# EAGLE design PCB v.2_2021 (EAGLE 9.6.2)
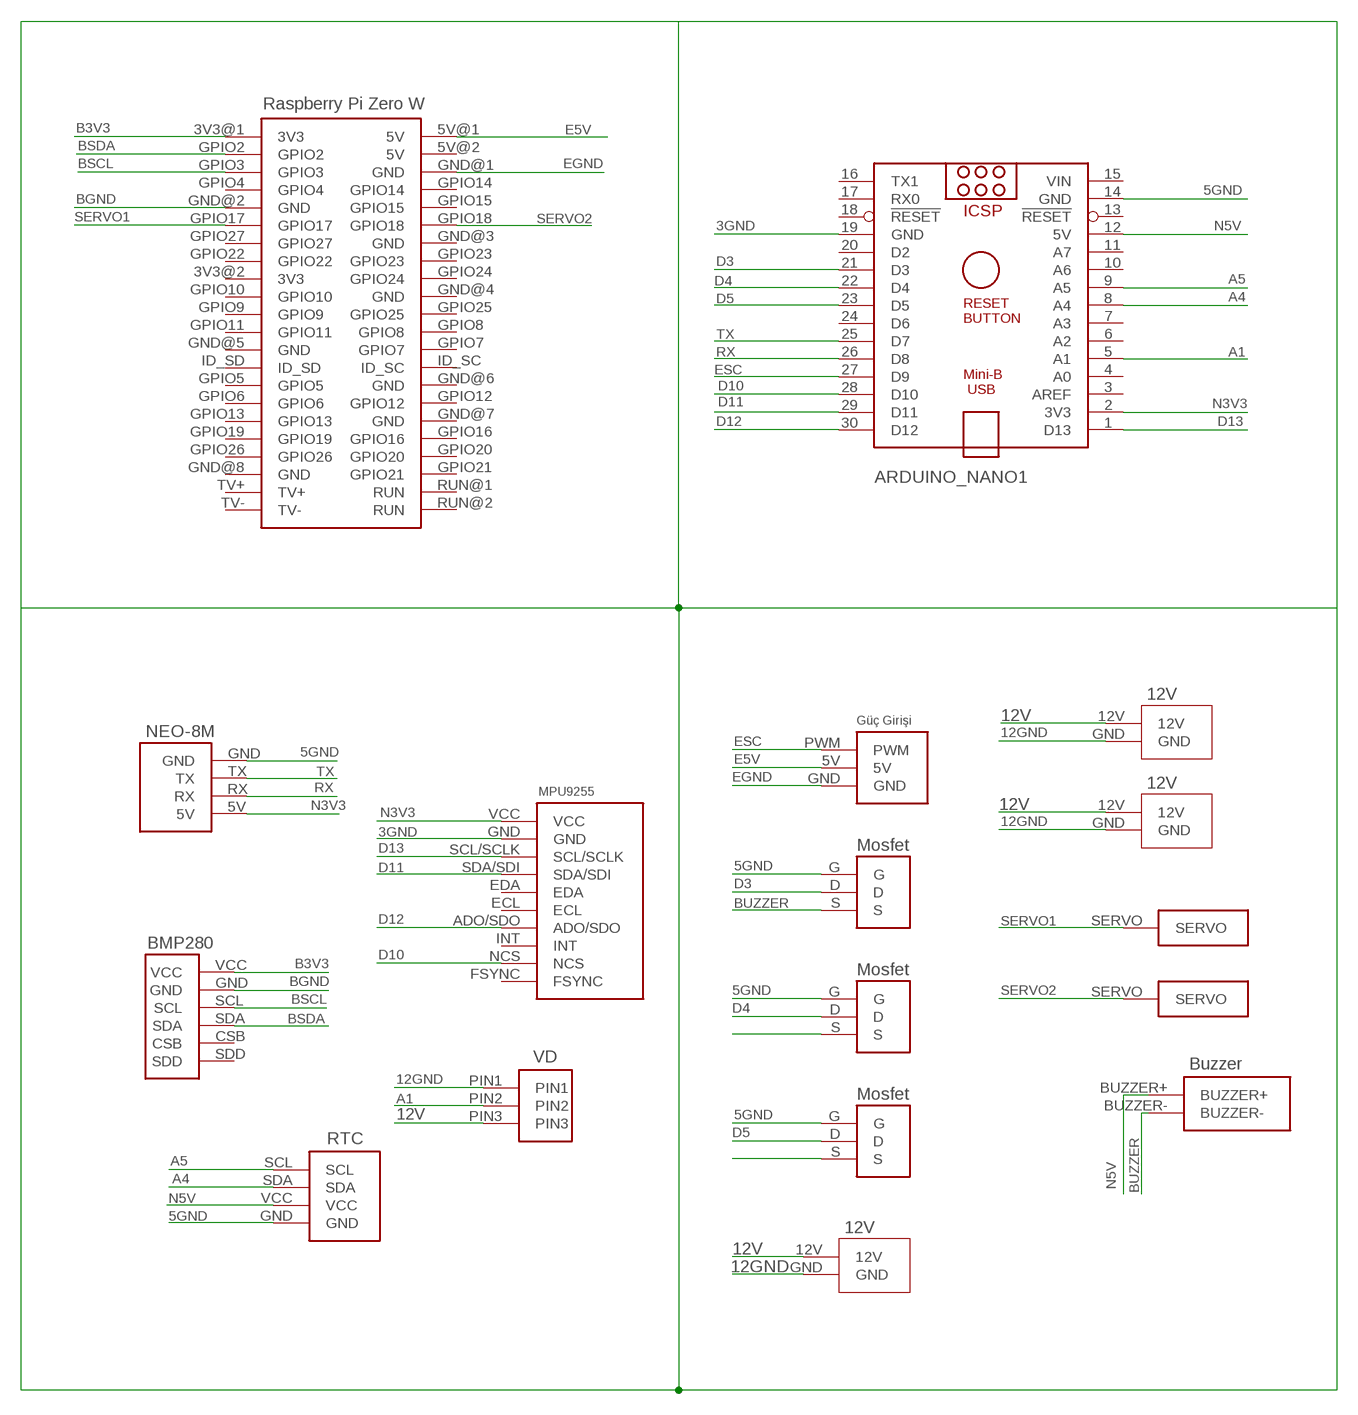
[diagram p0: schematic, sheet 1]

## Parts
ARDUINO_NANO1  ARDUINO_NANO  [ARDUINO_NANO]
BMP1  BMP280  [BMP280]
RPIZEROW1  RASPBERRY_ZERO_W  [RASPBERRY_ZERO_W]
U$1  NEOM8N  [NEO8M]
U$2  MPU9255  [MPU9255]
U$3  VOLTAGE_DIVIDER  [VOLTAGE_DIVIDER]
U$4  ESC_GIRIS  [ESC_GIRIS]
U$5  12V  [12V]
U$6  12V  [12V]
U$7  MOSFET  [MOSFET]
U$8  MOSFET  [MOSFET]
U$9  MOSFET  [MOSFET]
U$10  RTC  [RTC]
U$11  SERVO_SIGNAL  [SERVO_SIGNAL]
U$12  SERVO_SIGNAL  [SERVO_SIGNAL]
U$13  12V  [12V]
U$14  BUZZER  [BUZZER]

## Nets
3GND: ARDUINO_NANO1.19(GND) U$2.GND
5GND: ARDUINO_NANO1.14(GND) U$1.GND U$7.G U$8.G U$9.G U$10.GND
12GND: U$3.PIN1 U$5.GND U$6.GND U$13.GND
12V: U$3.PIN3 U$5.12V U$6.12V U$13.12V
A1: ARDUINO_NANO1.5(A1) U$3.PIN2
A4: ARDUINO_NANO1.8(A4) U$10.SDA
A5: ARDUINO_NANO1.9(A5) U$10.SCL
B3V3: BMP1.VCC RPIZEROW1.3V3@1(3V3)
BGND: BMP1.GND RPIZEROW1.GND@2(GND)
BSCL: BMP1.SCL RPIZEROW1.GPIO3
BSDA: BMP1.SDA RPIZEROW1.GPIO2
BUZZER: U$7.S U$14.BUZZER-
D3: ARDUINO_NANO1.21(D3) U$7.D
D4: ARDUINO_NANO1.22(D4) U$8.D
D5: ARDUINO_NANO1.23(D5) U$9.D
D10: ARDUINO_NANO1.28(D10) U$2.NCS
D11: ARDUINO_NANO1.29(D11) U$2.SDA/SDI
D12: ARDUINO_NANO1.30(D12) U$2.ADO/SDO
D13: ARDUINO_NANO1.1(D13) U$2.SCL/SCLK
E5V: RPIZEROW1.5V@1(5V) U$4.5V
EGND: RPIZEROW1.GND@1(GND) U$4.GND
ESC: ARDUINO_NANO1.27(D9) U$4.PWM
N3V3: ARDUINO_NANO1.2(3V3) U$1.5V U$2.VCC
N5V: ARDUINO_NANO1.12(5V) U$10.VCC U$14.BUZZER+
N$7: U$8.S
N$10: U$9.S
RX: ARDUINO_NANO1.26(D8) U$1.RX
SERVO1: RPIZEROW1.GPIO17 U$11.SERVO
SERVO2: RPIZEROW1.GPIO18 U$12.SERVO
TX: ARDUINO_NANO1.25(D7) U$1.TX
Unconnected: ARDUINO_NANO1.3(AREF) ARDUINO_NANO1.4(A0) ARDUINO_NANO1.6(A2) ARDUINO_NANO1.7(A3) ARDUINO_NANO1.10(A6) ARDUINO_NANO1.11(A7) ARDUINO_NANO1.13(!RESET) ARDUINO_NANO1.16(TX1) ARDUINO_NANO1.17(RX0) ARDUINO_NANO1.18(!RESET) ARDUINO_NANO1.20(D2) ARDUINO_NANO1.24(D6) BMP1.CSB BMP1.SDD RPIZEROW1.3V3@2(3V3) RPIZEROW1.5V@2(5V) RPIZEROW1.GND@3(GND) RPIZEROW1.GND@4(GND) RPIZEROW1.GND@5(GND) RPIZEROW1.GND@6(GND) RPIZEROW1.GND@7(GND) RPIZEROW1.GND@8(GND) RPIZEROW1.GPIO4 RPIZEROW1.GPIO5 RPIZEROW1.GPIO6 RPIZEROW1.GPIO7 RPIZEROW1.GPIO8 RPIZEROW1.GPIO9 RPIZEROW1.GPIO10 RPIZEROW1.GPIO11 RPIZEROW1.GPIO12 RPIZEROW1.GPIO13 RPIZEROW1.GPIO14 RPIZEROW1.GPIO15 RPIZEROW1.GPIO16 RPIZEROW1.GPIO19 RPIZEROW1.GPIO20 RPIZEROW1.GPIO21 RPIZEROW1.GPIO22 RPIZEROW1.GPIO23 RPIZEROW1.GPIO24 RPIZEROW1.GPIO25 RPIZEROW1.GPIO26 RPIZEROW1.GPIO27 RPIZEROW1.ID_SC RPIZEROW1.ID_SD RPIZEROW1.RUN@1(RUN) RPIZEROW1.RUN@2(RUN) RPIZEROW1.TV+ RPIZEROW1.TV- U$2.ECL U$2.EDA U$2.FSYNC U$2.INT

## Power pins joined to a net without a drawn wire
VIN: ARDUINO_NANO1.15(VIN)

## Library data of the parts
ARDUINO_NANO1 = ArduinoNanoV30:ARDUINO_NANO: Arduino Nano V3.0 Overview: The Arduino Nano is a small, complete, and breadboard-friendly board based on the ATmega328 (Arduino Nano 3.x) or ATmega168 (Arduino Nano 2.x). It has more or less the same functionality of the Arduino Duemilanove, but in a different package. It lacks only a DC power jack, and works with a Mini-B USB cable instead of a standard one. The Nano was designed and is being produced by Gravitech. Specifications: Microcontroller Atmel ATmega168 or ATmega328 Operating Voltage (logic level) 5 V Input Voltage (recommended) 7-12 V Input Voltage (limits) 6-20 V Digital I/O Pins 14 (of which 6 provide PWM output) Analog Input Pins 8 DC Current per I/O Pin 40 mA Flash Memory 16 KB (ATmega168) or 32 KB (ATmega328) of which 2 KB used by bootloader SRAM 1 KB (ATmega168) or 2 KB (ATmega328) EEPROM 512 bytes (ATmega168) or 1 KB (ATmega328) Clock Speed 16 MHz Dimensions 0.73" x 1.70" Length 45 mm Width 18 mm Weigth 5 g Power: The Arduino Nano can be powered via the Mini-B USB connection, 6-20V unregulated external power supply (pin 30), or 5V regulated external power supply (pin 27). The power source is automatically selected to the highest voltage source. Memory: The ATmega168 has 16 KB of flash memory for storing code (of which 2 KB is used for the bootloader); the ATmega328 has 32 KB, (also with 2 KB used for the bootloader). The ATmega168 has 1 KB of SRAM and 512 bytes of EEPROM (which can be read and written with the EEPROM library); the ATmega328 has 2 KB of SRAM and 1 KB of EEPROM. Input and Output: Each of the 14 digital pins on the Nano can be used as an input or output, using pinMode(), digitalWrite(), and digitalRead() functions. They operate at 5 volts. Each pin can provide or receive a maximum of 40 mA and has an internal pull-up resistor (disconnected by default) of 20-50 kOhms. In addition, some pins have specialized functions. Visit Arduino - ArduinoBoardNano <https://www.arduino.cc/en/Main/ArduinoBoardNano>
BMP1 = SpatiumB:BMP280
RPIZEROW1 = SpatiumB:RASPBERRY_ZERO_W
U$1 = SpatiumB:NEOM8N
U$2 = SpatiumB:MPU9255
U$3 = SpatiumB:VOLTAGE_DIVIDER
U$4 = SpatiumB:ESC_GIRIS
U$5 U$6 U$13 = SpatiumB:12V
U$7-U$9 = SpatiumB:MOSFET
U$10 = SpatiumB:RTC
U$11 U$12 = SpatiumB:SERVO_SIGNAL
U$14 = SpatiumB:BUZZER

## Board
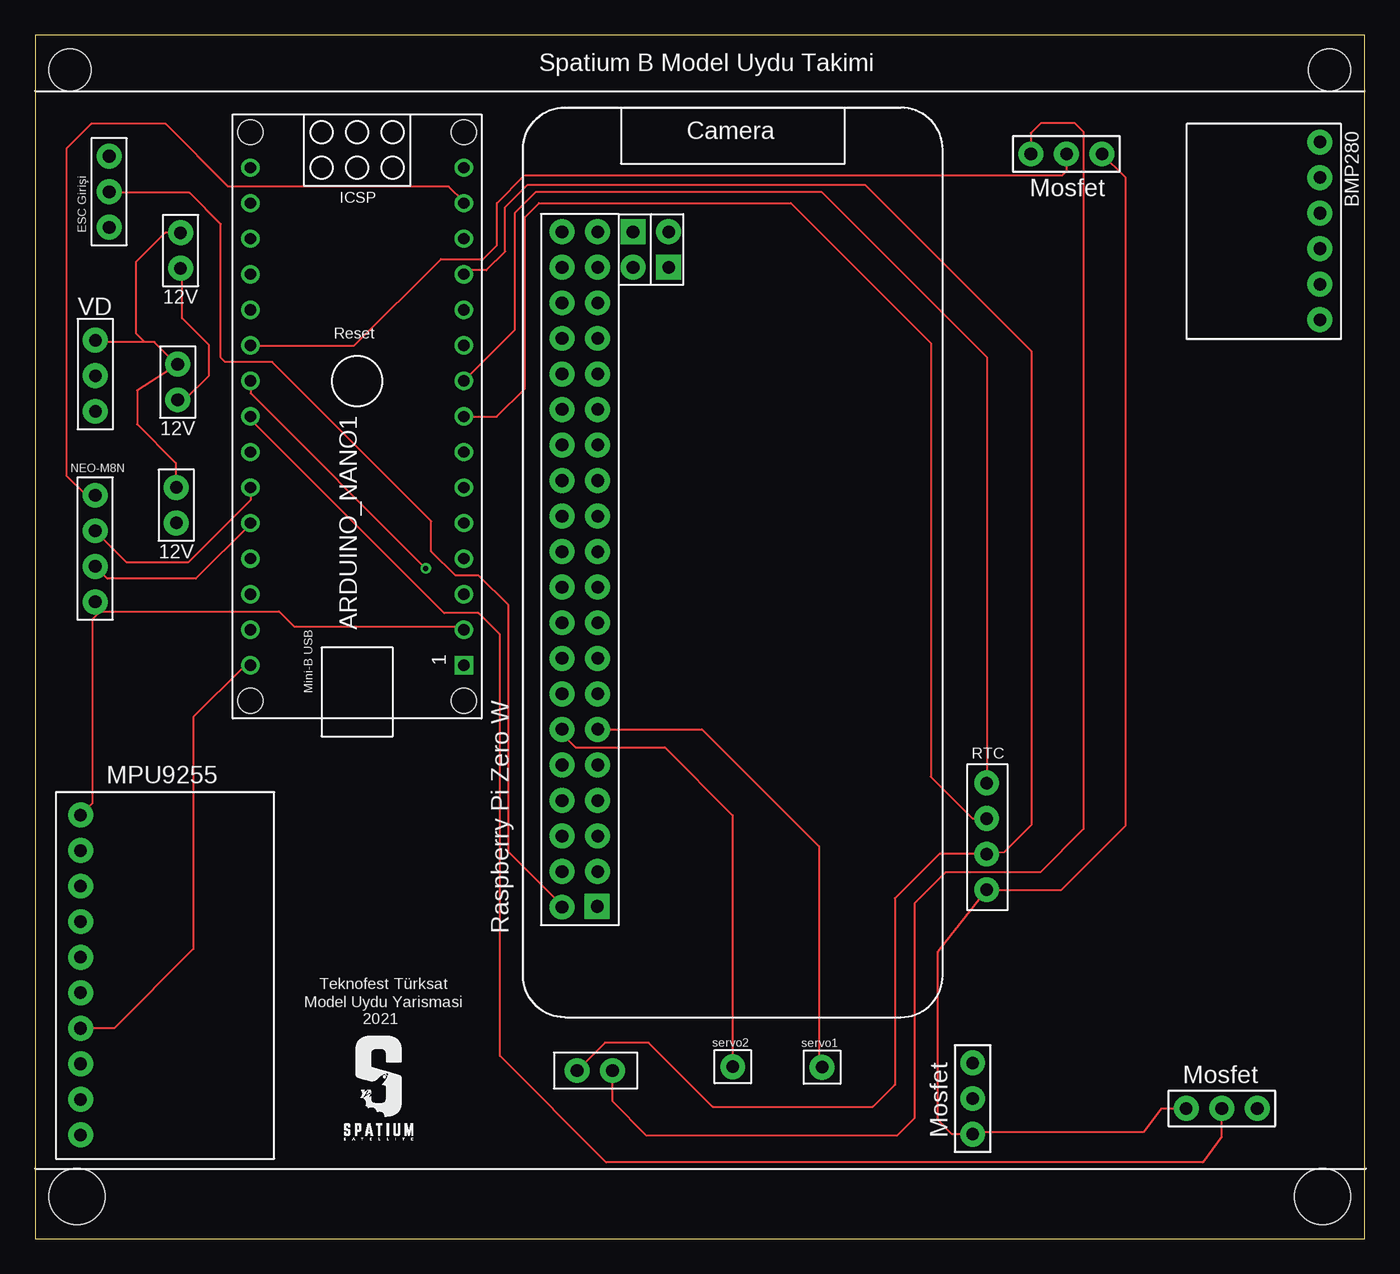
[diagram p1: board, top side]
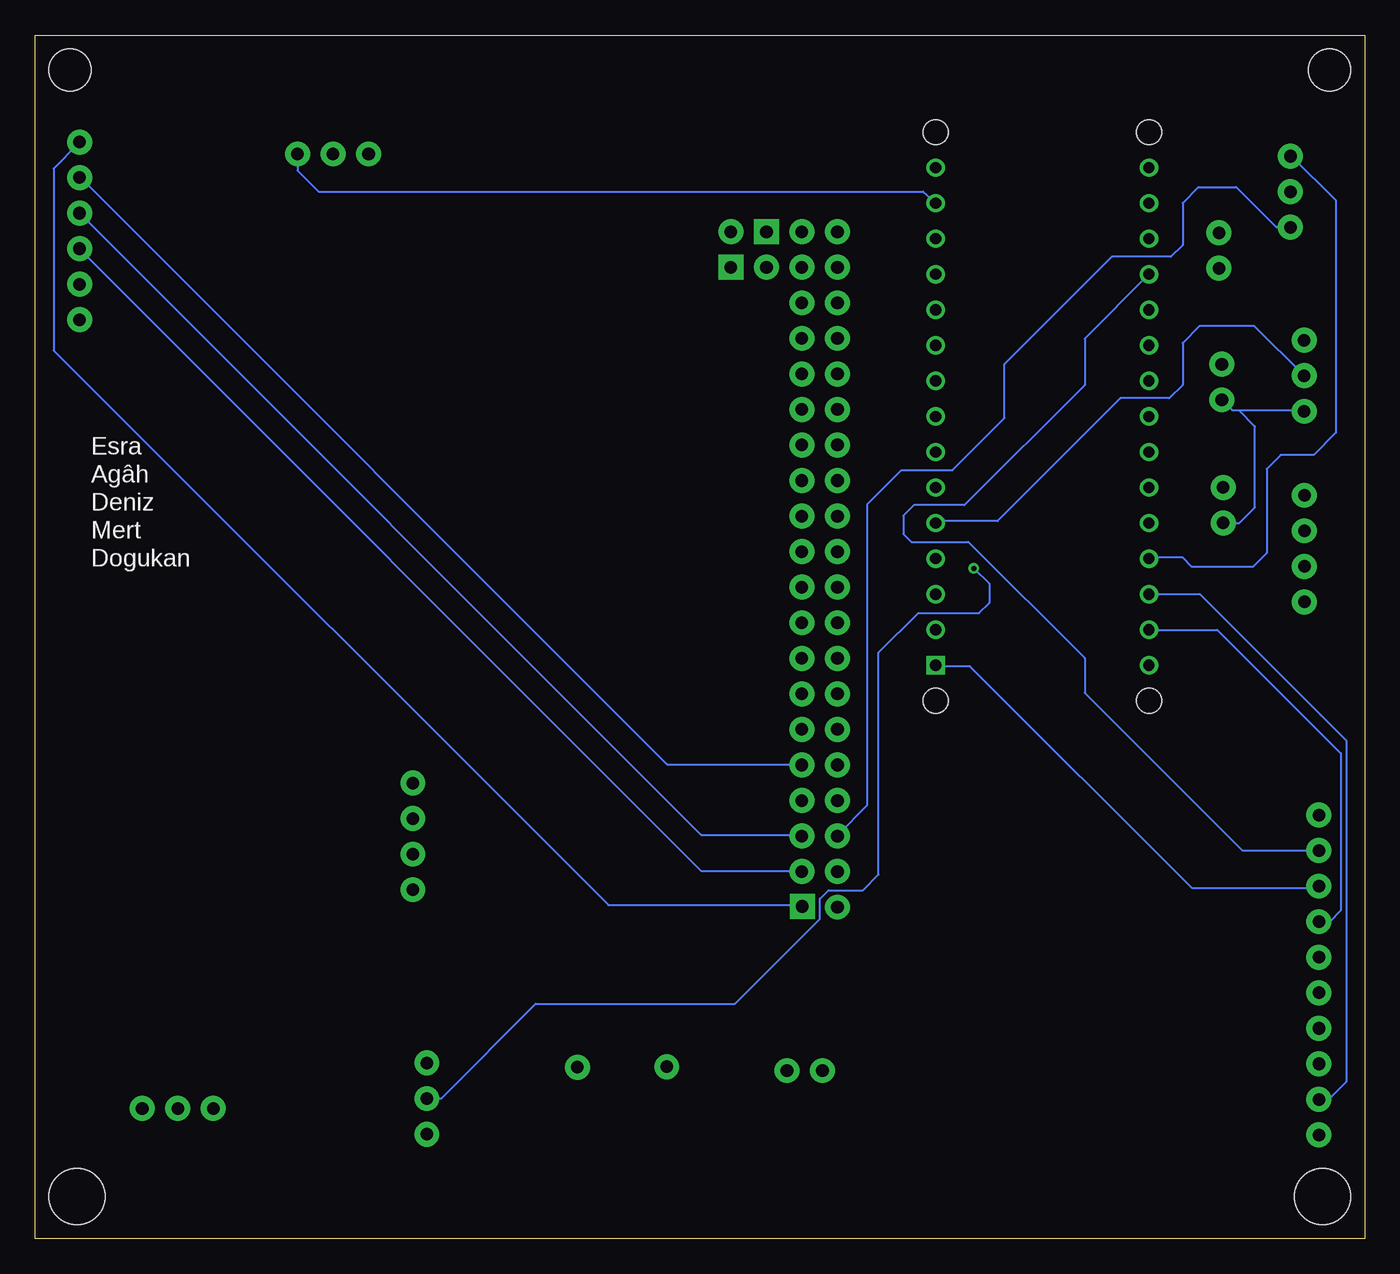
[diagram p2: board, bottom side, seen from below]

Size 95 x 86 mm. Coordinates in mm from the lower left corner, seen from the top.
Outline: 0,0 95,0 95,86 0,86 0,0
Copper layers (1*16): Top 0.035mm / dielectric 1.5mm / Bottom 0.035mm
Design rules "default": minimum track width 6mil, minimum drill 0.35mm, track to track 6mil, track to pad 6mil, pad to pad 6mil, via to via 6mil, smd to smd 6mil, copper to edge 40mil, drill to drill 6mil, minimum pad ring 10mil, minimum via ring 8mil, stop-mask expansion 4mil, vias tented up to drill 0mil, thermal gap 10mil
Holes 3 mm at 2.5,83.5 92.5,83.5
Holes 4 mm at 92,3 3,3

### Footprints (pad centres in the part's own frame; a part is rotated, then mirrored left to right if it is on the bottom)
ARDUINO_NANO = drill 0.8 square: 1 -20.32,-7.62 | drill 0.8: 2 -17.78,-7.62; 3 -15.24,-7.62; 4 -12.7,-7.62; 5 -10.16,-7.62; 6 -7.62,-7.62; 7 -5.08,-7.62; 8 -2.54,-7.62; 9 0,-7.62; 10 2.54,-7.62; 11 5.08,-7.62; 12 7.62,-7.62; 13 10.16,-7.62; 14 12.7,-7.62; 15 15.24,-7.62; 16 15.24,7.62; 17 12.7,7.62; 18 10.16,7.62; 19 7.62,7.62; 20 5.08,7.62; 21 2.54,7.62; 22 0,7.62; 23 -2.54,7.62; 24 -5.08,7.62; 25 -7.62,7.62; 26 -10.16,7.62; 27 -12.7,7.62; 28 -15.24,7.62; 29 -17.78,7.62; 30 -20.32,7.62 | hole 1.778: -22.86,-7.62; -22.86,7.62; 17.78,7.62; 17.78,-7.62
BMP280 = drill 0.9 pad 1.778: CSB 3.81,3.81; GND -3.81,3.81; SCL -1.27,3.81; SDA 1.27,3.81; SDD 6.35,3.81; VCC -6.35,3.81
RASPBERRY_ZERO_W = drill 0.9 pad 1.778 square: 3V3@1 -24.079,9.685; RUN@2 24.13,7.128; TV+ 21.59,4.588 | drill 0.9 pad 1.778: 3V3@2 -3.81,9.66; 5V@1 -24.13,12.2; 5V@2 -21.59,12.2; GND@1 -19.05,12.2; GND@2 -13.97,9.66; GND@3 -8.89,12.2; GND@4 -1.27,12.2; GND@5 6.35,9.66; GND@6 11.43,12.2; GND@7 16.51,12.2; GND@8 24.13,9.66; GPIO2 -21.59,9.66; GPIO3 -19.05,9.66; GPIO4 -16.51,9.66; GPIO5 11.43,9.66; GPIO6 13.97,9.66; GPIO7 6.35,12.2; GPIO8 3.81,12.2; GPIO9 1.27,9.66; GPIO10 -1.27,9.66; GPIO11 3.81,9.66; GPIO12 13.97,12.2; GPIO13 16.51,9.66; GPIO14 -16.51,12.2; GPIO15 -13.97,12.2; GPIO16 19.05,12.2; GPIO17 -11.43,9.66; GPIO18 -11.43,12.2; GPIO19 19.05,9.66; GPIO20 21.59,12.2; GPIO21 24.13,12.2; GPIO22 -6.35,9.66; GPIO23 -6.35,12.2; GPIO24 -3.81,12.2; GPIO25 1.27,12.2; GPIO26 21.59,9.66; GPIO27 -8.89,9.66; ID_SC 8.89,12.2; ID_SD 8.89,9.66; RUN@1 21.59,7.128; TV- 24.13,4.588
NEO8M = drill 0.9 pad 1.778: 5V 0,-3.81; GND 0,3.81; RX 0,-1.27; TX 0,1.27
MPU9255 = drill 0.9 pad 1.778: ADO/SDO -5.94,-4.18; ECL -5.94,-1.64; EDA -5.94,0.9; FSYNC -5.94,-11.8; GND -5.94,8.52; INT -5.94,-6.72; NCS -5.94,-9.26; SCL/SCLK -5.94,5.98; SDA/SDI -5.94,3.44; VCC -5.94,11.06
VOLTAGE_DIVIDER = drill 0.9 pad 1.778: PIN1 0,2.54; PIN2 0,0; PIN3 0,-2.54
ESC_GIRIS = drill 0.9 pad 1.778: 5V 0,0; GND -2.54,0; PWM 2.54,0
12V = drill 0.9 pad 1.778: 12V 0,1.27; GND 0,-1.27
MOSFET = drill 0.9 pad 1.778: D 0,0; G -2.54,0; S 2.54,0
RTC = drill 0.9 pad 1.778: GND 0,-3.54; SCL 0,4.08; SDA 0,1.54; VCC 0,-1
SERVO_SIGNAL = drill 0.9 pad 1.778: SERVO 0,0
BUZZER = drill 0.9 pad 1.778: BUZZER+ -1.27,0; BUZZER- 1.27,0

### Placement (x,y rotation side)
ARDUINO_NANO1  23.02,61.28 90 top
BMP1  88,72 270 top
RPIZEROW1  49.86,47.81 90 top
U$1  4.3,49.3 0 top
U$2  9.2,19.2 0 top
U$3  4.32,61.65 0 top
U$4  5.3,74.8 90 top
U$5  10.1,52.4 180 top
U$6  10.4,70.6 180 top
U$7  73.7,77.5 180 top
U$8  67,10 90 top
U$9  84.8,9.3 0 top
U$10  68,28.47 0 top
U$11  56.24,12.24 0 top
U$12  49.86,12.28 0 top
U$13  10.2,61.2 180 top
U$14  40,12 0 top

### Tracks (layer width: path | path; a pad name or v marks a point on that pad's centre or on a via)
3GND
  Bottom 0.152: 15.54,68.78 ARDUINO_NANO1.19 20,64.3 20,61 28.6,52.4 32.2,52.4 32.95,51.65 32.95,50.34 32.38,49.78 28.31,49.78 20,41.47 20,39 8.72,27.72 U$2.GND
5GND
  Top 0.152: U$9.G 80.49,9.3 79.19,7.6 67.23,7.6 67.11,7.57 U$8.G 65.53,7.46 64.52,8.47 64.52,20.47 U$10.GND 73.35,24.93 77.9,29.48 77.9,75.84 U$7.G | U$1.GND 3.66,53.11 2.25,54.52 2.25,77.87 4.02,79.64 9.33,79.64 13.8,75.18 29.57,75.18 30.63,74.11 ARDUINO_NANO1.14
  Bottom 0.152: U$7.G 76.24,76.31 74.75,74.81 31.54,74.81 ARDUINO_NANO1.14
12GND
  Top 0.152: 7.84,64.06 8.53,64.06 10.06,62.53 U$13.GND 7.29,60.61 7.29,58.18 10.06,55.42 10.06,53.69 U$5.GND | 7.84,64.06 4.42,64.06 U$3.PIN1 | U$6.GND 9.32,71.87 7.2,69.75 7.2,64.7 7.84,64.06
12V
  Top 0.152: U$13.12V 10.7,59.93 12.43,61.66 12.43,63.84 10.52,65.75 10.52,69.24 U$6.12V
  Bottom 0.152: 9,59.18 9.45,59.18 10.06,59.79 U$13.12V | 9,59.18 4.42,59.18 U$3.PIN3 | U$5.12V 8.95,51.13 7.84,52.24 7.84,58.02 9,59.18
A1
  Bottom 0.152: U$3.PIN2 7.88,65.21 11.79,65.21 13,64 13,61 13.95,60.05 17.44,60.05 26.23,51.25 30.63,51.25 ARDUINO_NANO1.5
A4
  Top 0.152: ARDUINO_NANO1.8 30.79,58.72 32.99,58.72 35,60.73 35,73 36,74 54,74 64,64 64,33 66.99,30.01 U$10.SDA 67.97,30.07
A5
  Top 0.152: 30.79,61.16 ARDUINO_NANO1.9 34.3,64.94 34.3,73.3 35.8,74.8 56.2,74.8 68,63 U$10.SCL
B3V3
  Bottom 0.152: RPIZEROW1.3V3@1 40.23,23.82 54.03,23.82 93.66,63.45 93.66,76.46 91.9,78.23 BMP1.VCC
BGND
  Bottom 0.152: RPIZEROW1.GND@2 40.23,33.88 49.84,33.88 91.75,75.79 BMP1.GND
BSCL
  Bottom 0.152: RPIZEROW1.GPIO3 40.23,28.85 47.4,28.85 91.75,73.2 BMP1.SCL
BSDA
  Bottom 0.152: RPIZEROW1.GPIO2 40.23,26.26 47.4,26.26 91.75,70.61 BMP1.SDA
BUZZER
  Top 0.152: U$7.S 71.16,78.99 71.86,79.69 74.32,79.69 74.93,79.08 74.93,29.26 71.83,26.16 65.07,26.16 62.85,23.95 62.85,8.6 61.6,7.35 43.71,7.35 41.27,9.79 U$14.BUZZER-
D3
  Top 0.152: U$7.D 73.7,76.26 73.39,75.95 34.95,75.95 33,74 33,71 32,70 29,70 22.82,63.82 ARDUINO_NANO1.21 15.54,63.9
D4  (via drill 0.35)
  Top 0.152: v27.92,47.89 15.4,60.41 ARDUINO_NANO1.22
  Bottom 0.152: v27.92,47.89 26.82,46.79 26.82,45.42 27.54,44.7 31.89,44.7 34.72,41.87 34.72,26.01 35.84,24.89 38.3,24.89 38.91,24.27 38.91,22.86 45,16.77 59.23,16.77 66,10 U$8.D
D5
  Top 0.152: ARDUINO_NANO1.23 15.4,58.53 29.24,44.7 31.69,44.7 33.22,43.17 33.22,13.04 40.81,5.44 83.44,5.44 84.8,7.3 U$9.D
D10
  Bottom 0.152: ARDUINO_NANO1.28 11.78,46.04 1.28,35.54 1.28,11.23 2.57,9.94 U$2.NCS
D11
  Bottom 0.152: ARDUINO_NANO1.29 10.52,43.5 1.68,34.66 1.68,23.45 2.49,22.64 U$2.SDA/SDI
D12
  Top 0.152: ARDUINO_NANO1.30 15.39,40.89 14.94,40.89 11.32,37.28 11.32,20.68 5.66,15.02 U$2.ADO/SDO
D13
  Bottom 0.152: ARDUINO_NANO1.1 30.63,40.89 28.18,40.89 12.35,25.05 3.39,25.05 U$2.SCL/SCLK
E5V
  Top 0.152: U$4.5V 5.33,74.72 11.04,74.72 13.28,72.49 13.28,62.95 13.6,62.63 16.95,62.63 28.32,51.26 28.32,49.11 30.04,47.39 31.69,47.39 33.82,45.25 33.82,27.64 37.64,23.82 RPIZEROW1.5V@1
EGND
  Bottom 0.152: U$4.GND 6.3,72.26 9.17,75.13 11.87,75.13 13,74 13,71 13.85,70.15 18.05,70.15 | 18.05,70.15 25.72,62.48 25.72,58.63 29.44,54.91 33.09,54.91 35.52,52.47 35.52,30.97 37.64,28.85 RPIZEROW1.GND@1 | 18.05,70.15 18.04,70.16
ESC
  Bottom 0.152: ARDUINO_NANO1.27 15.39,48.66 13,48.66 12.34,48 8,48 7,49 7,55 6,56 3.64,56 2.05,57.59 2.05,74.18 5.18,77.31 U$4.PWM
N3V3
  Top 0.152: 4.68,44.81 17.44,44.81 18.51,43.73 30.63,43.73 ARDUINO_NANO1.2 | 4.88,45.01 4.42,45.46 U$1.5V 4.88,45.01 | 4.88,45.01 4.68,44.81 | 4.68,44.81 4.1,44.23 4.1,31.1 U$2.VCC
N5V
  Top 0.152: ARDUINO_NANO1.12 30.92,69.18 32.25,69.18 33.6,70.53 33.6,73.7 35.2,75.3 59.3,75.3 71.19,63.41 71.19,29.55 69.24,27.6 U$10.VCC 64.61,27.47 61.45,24.3 61.45,11 | 61.45,11 61.45,10.95 | U$14.BUZZER+ 40.73,14 43.85,14 48.43,9.43 59.87,9.43 61.45,11
RX
  Top 0.152: ARDUINO_NANO1.26 15.4,51.07 11.49,47.15 5.18,47.15 U$1.RX
SERVO1
  Top 0.152: RPIZEROW1.GPIO17 47.66,36.38 56.02,28.02 56.02,12.46 U$11.SERVO
SERVO2
  Top 0.152: RPIZEROW1.GPIO18 37.66,36.08 38.64,35.1 45,35.1 49.86,30.24 U$12.SERVO
TX
  Top 0.152: ARDUINO_NANO1.25 15.4,52.76 10.96,48.32 6.55,48.32 U$1.TX

### Text on the board
tPlace: servo2 | servo1
tNames: Spatium B Model Uydu Takimi | Teknofest Türksat | Model Uydu Yarismasi | 2021
bNames: Esra | Agâh | Deniz | Mert | Dogukan